# Altium schematic sheet STM32L051R8T6_PINOUT.SchDoc
size C; SheetNumber: 2; SheetTotal: 8
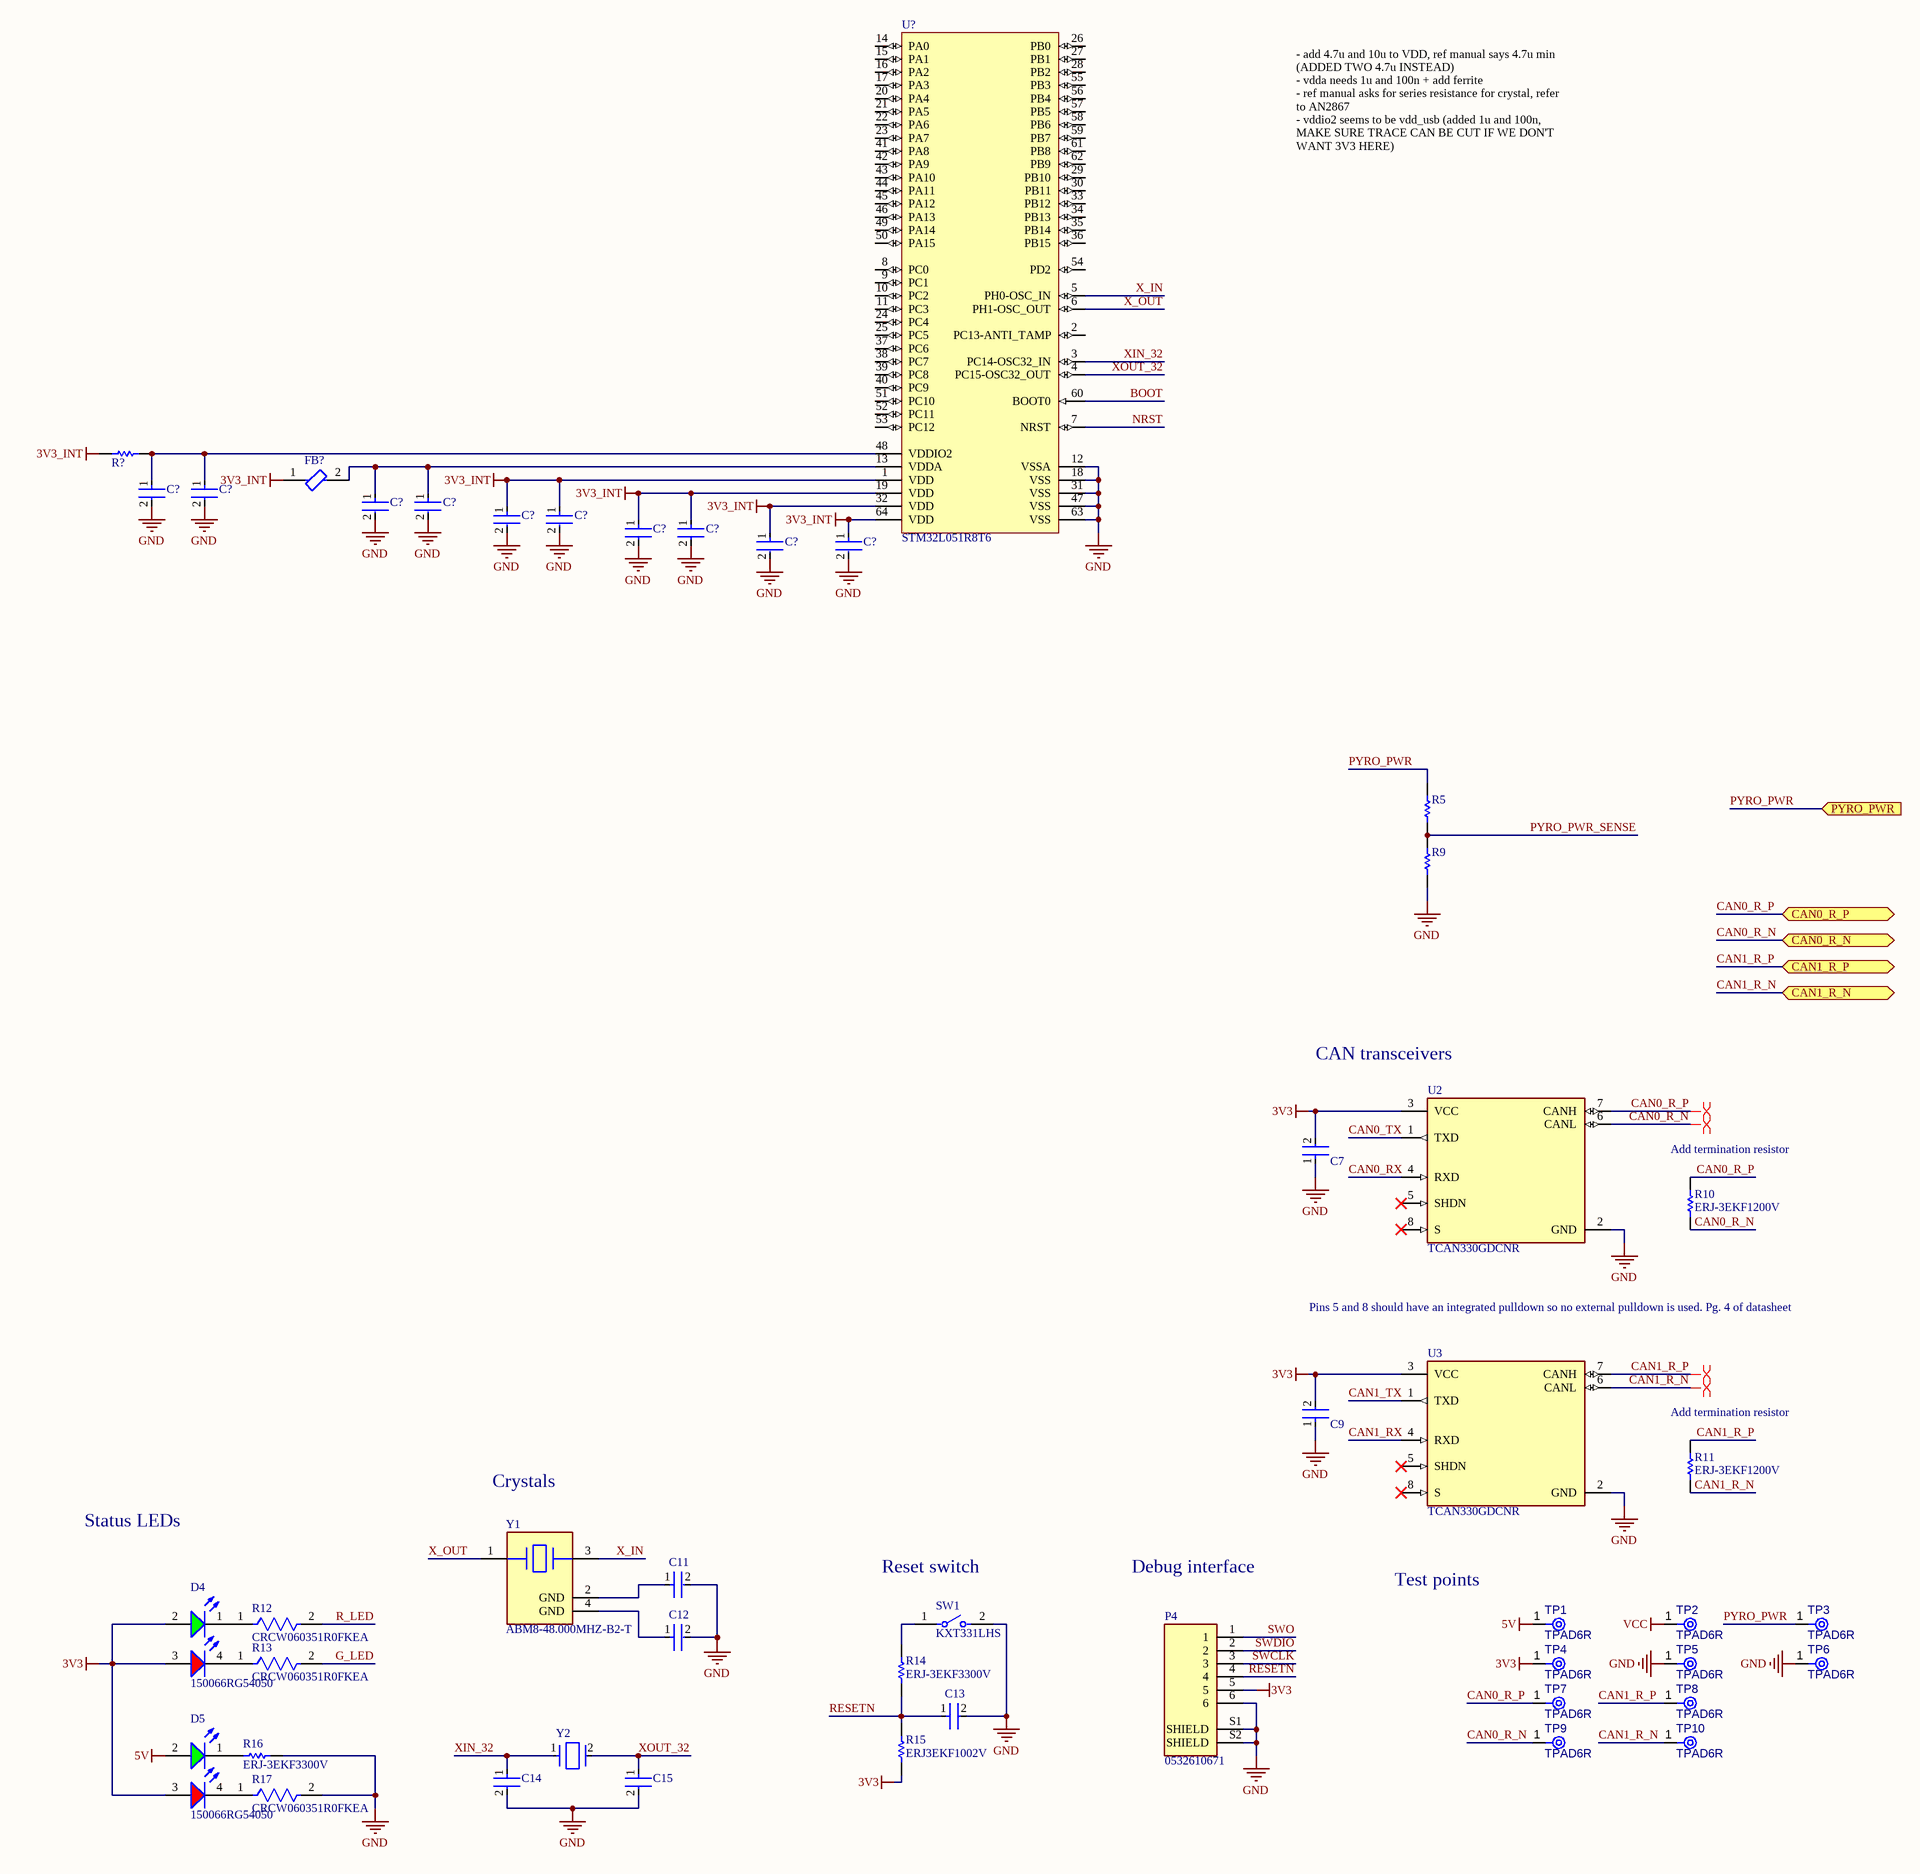
[diagram p0: STM32L051R8T6_PINOUT.SchDoc]

## Parts
(Parts that share a designator on the sheet are numbered #1, #2 ... from top to bottom, then left to right.)
C7  C0402C104K8PACTU  [FP-C0402-BB-MFG]  (value not drawn)
C9  C0402C104K8PACTU  [FP-C0402-BB-MFG]  (value not drawn)
C11  08051A6R8CAT2A  [FP-0805-L_2_01_0_2-W_1_25-MFG]  (value not drawn)
C12  08051A6R8CAT2A  [FP-0805-L_2_01_0_2-W_1_25-MFG]  (value not drawn)
C13  C0402C104K8PACTU  [FP-C0402-BB-MFG]  (value not drawn)
C14  C0805C180J5GACTU  [FP-C0805C-DN-MFG]  (value not drawn)
C15  C0805C180J5GACTU  [FP-C0805C-DN-MFG]  (value not drawn)
C?#1  1u  [FP-0402-L_1_0_0_05-W_0_5-IPC_A]  (value not drawn)
C?#2  100n  [FP-0402-L_1_0_0_05-W_0_5-IPC_A]  (value not drawn)
C?#3  1u  [FP-0402-L_1_0_0_05-W_0_5-IPC_A]  (value not drawn)
C?#4  100n  [FP-0402-L_1_0_0_05-W_0_5-IPC_A]  (value not drawn)
C?#5  4.7u  [FP-0402-L_1_0_0_05-W_0_5-IPC_A]  (value not drawn)
C?#6  100n  [FP-0402-L_1_0_0_05-W_0_5-IPC_A]  (value not drawn)
C?#7  4.7u  [FP-0402-L_1_0_0_05-W_0_5-IPC_A]  (value not drawn)
C?#8  100n  [FP-0402-L_1_0_0_05-W_0_5-IPC_A]  (value not drawn)
C?#9  100n  [FP-0402-L_1_0_0_05-W_0_5-IPC_A]  (value not drawn)
C?#10  100n  [FP-0402-L_1_0_0_05-W_0_5-IPC_A]  (value not drawn)
D4  150066RG54050  [WL-SBCD_0606]
D5  150066RG54050  [WL-SBCD_0606]
FB?  BLM15PX601SN1D  [FP-BLM15-0_05-MFG]  (value not drawn)
P4  0532610671  [0532610671-Footprint-1]
R5  ERJ3EKF1002V  [RESC1609X55X30LL15T15]  (value not drawn)
R9  CRCW06032K70JNEA  [RESC1609X50X30ML10T20]  (value not drawn)
R10  ERJ-3EKF1200V  [RESC1609X55X30ML15T15]
R11  ERJ-3EKF1200V  [RESC1609X55X30ML15T15]
R12  CRCW060351R0FKEA  [FP-CRCW0603-e3-MFG]
R13  CRCW060351R0FKEA  [FP-CRCW0603-e3-MFG]
R14  ERJ-3EKF3300V  [RESC1608X55X30LL15T15]
R15  ERJ3EKF1002V  [RESC1609X55X30LL15T15]
R16  ERJ-3EKF3300V  [RESC1608X55X30LL15T15]
R17  CRCW060351R0FKEA  [FP-CRCW0603-e3-MFG]
R?  0402 JUMPER 0 OHM  [RESC1005X40X25NL05T05]  (value not drawn)
SW1  KXT331LHS  [FP-KXT331LHS-MFG]
TP1  TPAD6R  [TP06R]  (no BOM)
TP2  TPAD6R  [TP06R]  (no BOM)
TP3  TPAD6R  [TP06R]  (no BOM)
TP4  TPAD6R  [TP06R]  (no BOM)
TP5  TPAD6R  [TP06R]  (no BOM)
TP6  TPAD6R  [TP06R]  (no BOM)
TP7  TPAD6R  [TP06R]  (no BOM)
TP8  TPAD6R  [TP06R]  (no BOM)
TP9  TPAD6R  [TP06R]  (no BOM)
TP10  TPAD6R  [TP06R]  (no BOM)
U2  TCAN330GDCNR  [FP-DCN0008A-MFG]
U3  TCAN330GDCNR  [FP-DCN0008A-MFG]
U?  STM32L051R8T6  [STM-LQFP64_V]
Y1  ABM8-48.000MHZ-B2-T  [FP-ABM8-MFG]
Y2  ECS-.327-12.5-1210-TR  [FP-ECX-1210-MFG]  (value not drawn)

## Ports
CAN0_R_N (bidir), CAN0_R_P (bidir), CAN1_R_N (bidir), CAN1_R_P (bidir), PYRO_PWR (in, see HYDRA_V3_POWER[5A])

## Nets
3V3: C7.2 C9.2 D4.2(A) D4.3(A) D5.3(A) P4.5 R15.1 TP4.1(TP) U2.3(VCC) U3.3(VCC)
3V3_INT: C?#5.1 C?#6.1 C?#7.1 C?#8.1 C?#9.1 C?#10.1 FB?.1 R?.1 U?.1(VDD) U?.19(VDD) U?.32(VDD) U?.64(VDD)
5V: D5.2(A) TP1.1(TP)
GND: C7.1 C9.1 C11.2 C12.2 C13.2 C14.2 C15.2 C?#1.2 C?#2.2 C?#3.2 C?#4.2 C?#5.2 C?#6.2 C?#7.2 C?#8.2 C?#9.2 C?#10.2 P4.6 P4.S1(SHIELD) P4.S2(SHIELD) R9.1 R16.2 R17.2 SW1.2 TP5.1(TP) TP6.1(TP) U2.2(GND) U3.2(GND) U?.12(VSSA) U?.18(VSS) U?.31(VSS) U?.47(VSS) U?.63(VSS)
VCC: TP2.1(TP)
BOOT: U?.60(BOOT0)
CAN0_R_N: R10.1 TP9.1(TP) U2.6(CANL) ; port CAN0_R_N
CAN0_R_P: R10.2 TP7.1(TP) U2.7(CANH) ; port CAN0_R_P
CAN0_RX: U2.4(RXD)
CAN0_TX: U2.1(TXD)
CAN1_R_N: R11.1 TP10.1(TP) U3.6(CANL) ; port CAN1_R_N
CAN1_R_P: R11.2 TP8.1(TP) U3.7(CANH) ; port CAN1_R_P
CAN1_RX: U3.4(RXD)
CAN1_TX: U3.1(TXD)
G_LED: R13.2
NRST: U?.7(NRST)
PYRO_PWR: R5.2 TP3.1(TP) ; port PYRO_PWR
PYRO_PWR_SENSE: R5.1 R9.2
R_LED: R12.2
RESETN: C13.1 P4.4 R14.1 R15.2
SWCLK: P4.3
SWDIO: P4.2
SWO: P4.1
X_IN: U?.5(PH0-OSC_IN) Y1.3
X_OUT: U?.6(PH1-OSC_OUT) Y1.1
XIN_32: C14.1 U?.3(PC14-OSC32_IN) Y2.1(In/Out)
XOUT_32: C15.1 U?.4(PC15-OSC32_OUT) Y2.2(Out/In)
NetC11_1: C11.1 Y1.2(GND)
NetC12_1: C12.1 Y1.4(GND)
NetC?#1_1: C?#1.1 C?#2.1 R?.2 U?.48(VDDIO2)
NetC?#3_1: C?#3.1 C?#4.1 FB?.2 U?.13(VDDA)
NetD4_1: D4.1(K) R12.1
NetD4_4: D4.4(K) R13.1
NetD5_1: D5.1(K) R16.1
NetD5_4: D5.4(K) R17.1
NetR14_2: R14.2 SW1.1

Not connected (* = marked no-connect by the designer): U2 5(SHDN)* 8(S)*; U3 5(SHDN)* 8(S)*; U? 2(PC13-ANTI_TAMP) 8(PC0) 9(PC1) 10(PC2) 11(PC3) 14(PA0) 15(PA1) 16(PA2) 17(PA3) 20(PA4) 21(PA5) 22(PA6) 23(PA7) 24(PC4) 25(PC5) 26(PB0) 27(PB1) 28(PB2) 29(PB10) 30(PB11) 33(PB12) 34(PB13) 35(PB14) 36(PB15) 37(PC6) 38(PC7) 39(PC8) 40(PC9) 41(PA8) 42(PA9) 43(PA10) 44(PA11) 45(PA12) 46(PA13) 49(PA14) 50(PA15) 51(PC10) 52(PC11) 53(PC12) 54(PD2) 55(PB3) 56(PB4) 57(PB5) 58(PB6) 59(PB7) 61(PB8) 62(PB9)

## Layout directives
differential pair: CAN0_R_N, CAN0_R_P, CAN1_R_N, CAN1_R_P

## Notes on the sheet
- - add 4.7u and 10u to VDD, ref manual says 4.7u min (ADDED TWO 4.7u INSTEAD)
  - vdda needs 1u and 100n + add ferrite
  - ref manual asks for series resistance for crystal, refer to AN2867
  - vddio2 seems to be vdd_usb (added 1u and 100n, MAKE SURE TRACE CAN BE CUT IF WE DON'T WANT 3V3 HERE)
- (near U2) CAN transceivers
- (near R10) Add termination resistor
- Pins 5 and 8 should have an integrated pulldown so no external pulldown is used. Pg. 4 of datasheet
- (near R11) Add termination resistor
- Crystals
- Status LEDs
- (near SW1) Reset switch
- Debug interface
- Test points

## Library data of the parts
C7 C9 C13 = CMP-2008-02046-2: CAP CER 0.1UF 10V X5R 0402; Manufacturer: Kemet; Material: Ceramic; Capacitance: 0.10 μF; Temperature Coefficient: 15%; Tolerance: 0.1; Value: 0.10 μF; Package: C0402-BB; Temperature: -55°C to +125°C; ComponentLink2Description: Datasheet; Temperature Characteristic: X5R; Device Class L1: Passive Components; Height: 0.55mm; Lead Free: Yes; ComponentLink2URL: https://content.kemet.com/datasheets/KEM_C1002_X7R_SMD.pdf; Device Class L2: Capacitors; Temperature Range Low: -55°C; Temperature Range High: +125°C; RoHS: TRUE; Octopart: https://octopart.com/c0402c104k8pactu-kemet-140039; Automotive: No; Mouser Description: Capacitor 100 nF 10 VDC 0402; Category: Cap; Voltage Rating: 10 V; Digikey Description: CAP CER 0.1UF 10V X5R 0402; Ipc Land Pattern Name: CAPC10050X50; Device Class L3: Ceramic Capacitors; Manufacturer Part Number: C0402C104K8PACTU
C11 C12 = CMP-1036-00709-3: General Purpose Ceramic Capacitor, 0805, 6.8pF, 0.25pF, C0G, 30ppm/°C, 100V; Dissipation Factor: 10%; Insulation Resistance: 100GR; Tolerance: 5%; Max Operating Temperature: 125°C; RoHS Compliant: Yes; Capacitance: 6.8pF; Termination: SMD/SMT; Number of Pins: 2; Packaging: Tape and Reel; Mount: Surface Mount; Case Code (Metric): 2012; Case Code (Imperial): 0805; Height: 0.71mm; Min Operating Temperature: -55°C; Width: 0.049inch; Temperature Coefficient: 0ppm/°C; Length: 2.01mm; Dielectric: C0G; Series: -; Voltage Rating (DC): 100V; Dielectric Material: Ceramic; Depth: 1.25mm; Contact Plating: Tin; Voltage Rating: 100V; Thickness: 0.037inch; Case/Package: 0805; Lead Free: Lead Free; Radiation Hardening: No; Voltage: 100V; Construction: Flat; Package Quantity: 1; REACH SVHC: No SVHC
C14 C15 = CMP-2007-00302-2: CAP CER 18PF 50V C0G/NP0 0805; Manufacturer: KEMET; Temperature Characteristic: C0G; Tolerance: 0.05; Material: Ceramic; Temperature Coefficient: 30ppm/°C; Device Class L2: Capacitors; Capacitance: 18 pF; Temperature: -55°C to +125°C; Value: 18 pF; Package: C0805C-DN; Mouser Description: Cap Ceramic 18pF 50V C0G 5% SMD 0805 125C Paper T/R; Height: 0.88mm; ComponentLink2URL: https://content.kemet.com/datasheets/KEM_C1003_C0G_SMD.pdf; RoHS: TRUE; Octopart: https://octopart.com/c0805c180j5gactu-kemet-144810; ComponentLink2Description: Datasheet; Temperature Range High: +125°C; Digikey Description: CAP CER 18PF 50V C0G/NP0 0805; Device Class L1: Passive Components; Category: Cap; Automotive: No; Device Class L3: Ceramic Capacitors; Voltage Rating: 50 V; Temperature Range Low: -55°C; Ipc Land Pattern Name: CAPC200125X78; Lead Free: Yes; Manufacturer Part Number: C0805C180J5GACTU
C?#1-C?#10 = CMP-001-00058-1: LARGE PADS, 0402 CAP, CHANGE COMMENT TO MATCH REAL P/N; Capacitor Type: Ceramic; Min Operating Temperature: -55°C; Mounting Technology: Surface Mount; Pins: 2; Case/Package: 0402; RoHS Compliant: Yes; Max Operating Temperature: 85°C
D4 D5 = CMP-004-00034-2: Led, Red/Grn, 180Mcd/230Mcd, 624Nm/525Nm Rohs Compliant: Yes
FB? = CMP-0686-00252-4: Chip Ferrite Bead, 0402, 600Ω @ 100MHz, 0.23Ω, 25%, 900mA; Number of Circuits: 1; Impedance: 600R; DC Resistance (DCR): 230mR; Material: Steel; Length: 1mm; Package Quantity: 10000; Height: 0.5mm; Width: 0.5mm; Max DC Current: 900mA; Number of Lines: 1; Termination: SMD/SMT; Packaging: Tape and Reel; Lead Free: Lead Free; Min Operating Temperature: -55°C; Max Operating Temperature: 125°C; Max Current Rating: 900mA; Case Code (Imperial): 0402; Number of Pins: 2; Current Rating: 900mA; Test Frequency: 100MHz; Case/Package: 0402; Tolerance: 25%; Case Code (Metric): 1005
P4 = CMP-002-00079-1: Conn Shrouded Header (4 Sides) HDR 6 POS 1.25mm Solder RA Side Entry SMD PicoBlade™ T/R
R5 R15 = CMP-1012-00623-3: Chip Resistor, 10 KOhm, +/- 1%, 0.1 W, -55 to 155 degC, 0603 (1608 Metric), RoHS, Tape and Reel; Manufacturer: Panasonic; Voltage Rating: 75V; Case\/Package: 0603; Power Rating: 100mW; Resistance: 10KOhm; Temperature Coefficient: 100ppm\/degreesC; Number of Pins: 2; Package Reference: 603; Depth: 0.8mm; Mount: SurfaceMount; Package Description: 2-Pin Surface Mount Device, Body 1.6 x 0.85 mm; Datasheet Version: 02/2017; Length: 1.6mm; Lead Free: LeadFree; Height: 0.45mm; Number of Terminations: 2; Max Power Dissipation: 100mW; Min Operating Temperature: -55degC; Datasheet URL: https://industrial.panasonic.com/cdbs/www-data/pdf/RDA0000/AOA0000C304.pdf; Termination: SMD/SMT; Case Code (Metric): 1608; Case Code (Imperial): 0603; Tolerance: 1%; Max Operating Temperature: 155degC; RoHSCompliant: true; Voltage Rating (DC): 75V; Radiation Hardening: No; Packaging: TapeandReel; Composition: ThickFilm; Mounting Technology: SurfaceMount; Manufacturer URL: http://www.panasonic.com/; Width: 0.031inch; REACH SVHC: NoSVHC; Contact Plating: Tin; Military Standard: Not; Package Quantity: 1
R9 = CMP-2000-03183-1: Manufacturer: Vishay Dale; Part Number: CRCW06032K70JNEA
R10 R11 = CMP-2000-00213-2: Chip Resistor, 120 Ohm, +/- 1%, 0.1 W, -55 to 155 degC, 0603 (1608 Metric), RoHS, Tape and Reel; Manufacturer: Panasonic; Power Rating: 100mW; Voltage Rating (DC): 75V; Resistance: 120Ohm; Temperature Coefficient: 100ppm/degreesC; Number of Terminations: 2; Military Standard: Not; Tolerance: 1%; Min Operating Temperature: -55degC; Packaging: TapeandReel; Lead Free: LeadFree; Max Operating Temperature: 155degC; Manufacturer URL: http://www.panasonic.com/; Case Code (Imperial): 0603; REACH SVHC: NoSVHC; Width: 0.031inch; Datasheet URL: https://industrial.panasonic.com/cdbs/www-data/pdf/RDA0000/AOA0000C283.pdf; RoHSCompliant: true; Max Power Dissipation: 100mW; Termination: SMD/SMT; Package Reference: 0603; Height: 0.022inch; Depth: 0.8mm; Package Description: 2-Pin Surface Mount Device, Body 1.6 x 0.85 mm; Contact Plating: Tin; Length: 1.6mm; Package URL: http://www.st.com/st-web-ui/static/active/en/resource/technical/document/datasheet/CD00001320.pdf; Radiation Hardening: No; Package Quantity: 1; Number of Pins: 2; Datasheet Version: 42095.0; Voltage Rating: 75V; Composition: ThickFilm; Case/Package: 0603; Mount: SurfaceMount; Case Code (Metric): 1608
R12 R13 R17 = CMP-2000-03446-2: RES Thick Film, 51Ω, 1%, 0.1W, 100ppm/°C, 0603; Power Rating: 100mW; Voltage Rating: 75V; Resistance: 51R; Military Standard: Not; Case Code (Imperial): 0603; Max Operating Temperature: 155°C; Temperature Coefficient: 100ppm/°C; Lead Free: Lead Free; Weight: 7.1E-05oz; Number of Pins: 2; Package Quantity: 10; Case/Package: 0603; Termination: SMD/SMT; Min Operating Temperature: -55°C; Tolerance: 1%; Contact Plating: Tin; Height: 0.45mm; Working Voltage: 75V; Radiation Hardening: No; Packaging: Tape and Reel; Composition: Thick Film; Max Power Dissipation: 100mW; Width: 0.85mm; Depth: 0.85mm; Length: 1.55mm; Case Code (Metric): 1608; Voltage Rating (DC): 75V; Number of Terminations: 2; Features: Automotive AEC-Q200
R14 R16 = CMP-2000-00435-2: Chip Resistor, 330 Ohm, +/- 1%, 0.1 W, -55 to 155 degC, 0603 (1608 Metric), RoHS, Tape and Reel; Gender: Male; Mating Cycles: 10000; Current Rating: 500 mA; Voltage Rating: 10 V; REACH SVHC: No SVHC; PackageDescription: 2-Pin Surface Mount Device, Body 1.6 x 0.85 mm; Contact Finish: Gold; Pins: 8; ComponentLink1Description: Manufacturer URL; Packaging: Tape and Reel; Max Operating Temperature: 85 degC; Contact Material: Copper; Height: 1.45 mm; Width: 1.45 mm; DatasheetVersion: Apr-15; Package Quantity: 1500; Contact Plating: Gold; PackageReference: 0603; Mount: Surface Mount; Lead Pitch: 1.1 mm; Min Operating Temperature: -25 degC; ComponentLink1URL: http://www.panasonic.com/; ComponentLink2URL: http://industrial.panasonic.com/cdbs/www-data/pdf/RDA0000/AOA0000C86.pdf; Length: 13.7 mm; ComponentLink2Description: Datasheet; RoHSCompliant: true
R? = CMP-009-00206-2: READ THE NAME
SW1 = CMP-10040-000029-1: SWITCH TACTILE SPST-NO 0.02A 15V; Operating Force: 240gf; Switch Travel: 0.13mm; Illumination Type: Non-Illuminated; Throw Configuration: SPST; Number of Ports: 1; Current Rating: 5A; Mechanical Life: 500000Cycles; Switch Function: Off-Mom; Connector Type: USB; Actuator Type: Standard; Gender: Receptacle; Number of Contacts: 24; Contact Plating: Gold; Insulation Color: Black; Min Operating Temperature: -40°C; Packaging: Tape and Reel; Flammability Rating: UL94 V-0; Max Operating Temperature: 85°C; Termination: Solder; Mount: Surface Mount
TP1-TP10 = CMP-00028-00002-2: 0.6mm round; Pins: 1
U2 U3 = CMP-04872-000178-1: IC TRANSCEIVER 1/1 SOT23-8; Data Rate: 1Mbps; Packaging: Tape and Reel; Min Operating Temperature: -40°C; Max Operating Temperature: 125°C; RoHS Compliant: Yes; Lead Free: Lead Free; Case/Package: SOT-23-8; Mount: Surface Mount
U? = CMP-1546-00010-1: Ultra-Low-Power ARM Cortex-M0+ MCU, 64 KB Flash, 1.8 to 3.6 V, -40 to 85 degC, 64-Pin LQFP, RoHS, Tray; Data EEPROM: 2 KB; VDD Max: 3.6 V; RAM: 8 KB; VDD Min: 1.8 V; Flash: 64 KB; Mounting Technology: Surface Mount; Temperature Max: 85 degC; ComponentLink3Description: Package Specification; DatasheetVersion: Rev. 4; ComponentLink2Description: Datasheet; PackageVersion: Rev. 6, 06/2013; ComponentLink2URL: http://www.st.com/st-web-ui/static/active/en/resource/technical/document/datasheet/DM00108219.pdf; ComponentLink3URL: http://www.st.com/st-web-ui/static/active/en/resource/technical/document/datasheet/DM00058181.pdf; ComponentLink1URL: http://www.st.com/web/en/home.html; ComponentLink1Description: Manufacturer URL; RoHS: TRUE; Temperature Min: -40 degC; PackageDescription: 64-Pin Frame Chip Scale Package, Body 10 x 10 mm, Pitch 0.5 mm; PartNumber: STM32L051R8T6; Packing: Tray
Y1 = CMP-27762-011708-1: Crystal 48MHz ±20ppm 18pF SMD-4 3.2mm x 2.5mm; Series Resistance: 35R; Frequency Stability: 50ppm; Package Quantity: 1000; Packaging: Tape and Reel; Mount: Surface Mount; Length: 3.2mm; Load Capacitance: 18pF; Max Operating Temperature: 70°C; Operating Frequency: 48 MHz; RoHS Compliant: Yes; Series: ABM8; Frequency Tolerance: 20ppm; Lead Free: Lead Free; Min Operating Temperature: -20°C; Case/Package: CSMD; Number of Pins: 4; Height: 0.031inch; ESR (Equivalent Series Resistance): 35R; Frequency: 48MHz; Radiation Hardening: No; Width: 0.098inch; Tolerance: 20ppm; Termination: SMD/SMT; Depth: 2.5mm; Resistor Type: Ceramic; REACH SVHC: No SVHC
Y2 = CMP-40224-000006-1: CRYSTAL 32.7680KHZ 12.5PF SMD; Manufacturer: ECS International; Frequency: 32.768kHz; Esr: 90kΩ; Tolerance: 20ppm; Device Class L1: Passive Components; Load Capacitance: 12.5pF; Temperature: -40°C to +85°C; ComponentLink2URL: https://ecsxtal.com/store/pdf/ECX-1210.pdf; Series: ECX-1210; Octopart: https://octopart.com/ecs-.327-12.5-1210-tr-ecs+international-81221340; ComponentLink2Description: Datasheet; Temperature Range Low: -40°C; Digikey Description: CRYSTAL 32.7680KHZ 12.5PF SMD; Lead Free: Yes; RoHS: TRUE; Device Class L3: Crystals; Automotive: No; Category: Crys; Height: 0.5mm; Manufacturer Part Number: ECS-.327-12.5-1210-TR; Temperature Range High: +85°C; Device Class L2: Crystals / Oscillators; Package: ECX-1210